# Altium schematic sheet 28Pins_Project_V1I1.SchDoc (part 2 of 3)
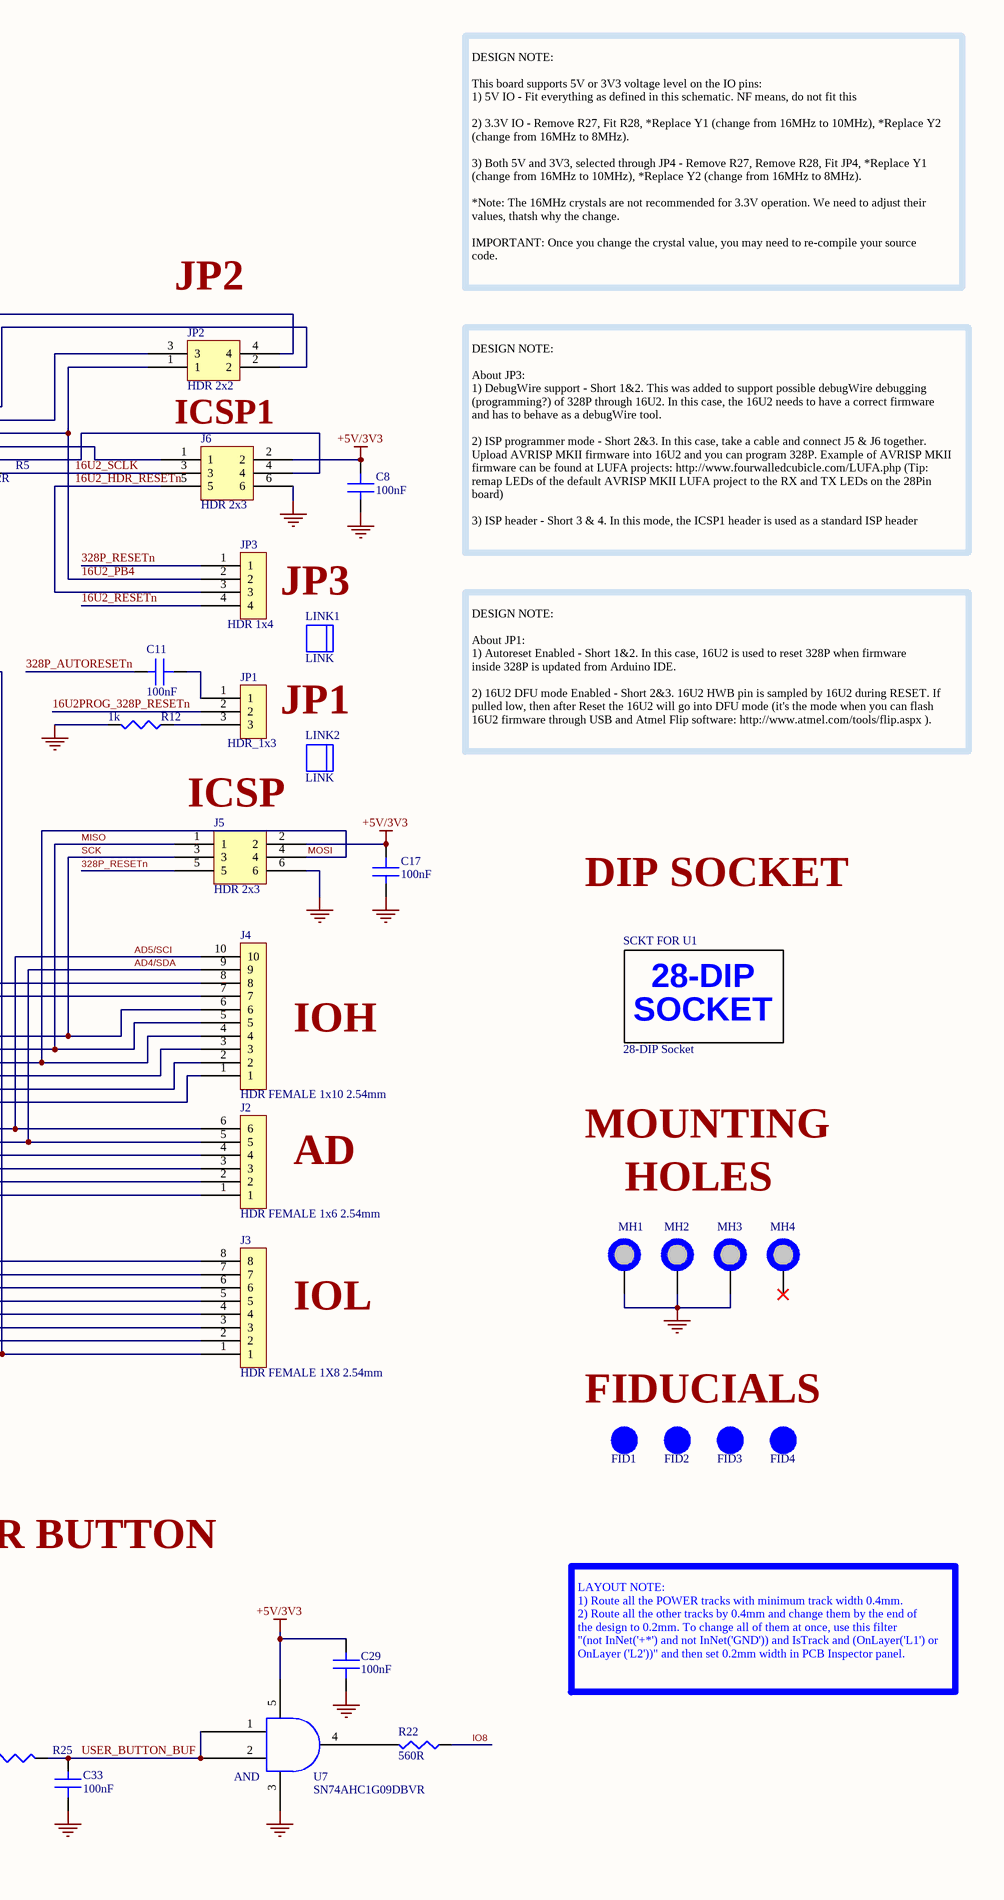
[diagram p2: 28Pins_Project_V1I1.SchDoc, right]
## Library data of the parts
C1 C2 = Tantal Capacitor: CAP ALUM 100UF 20% 10V SMD; Manufacturer: Panasonic; Manufacturer Part Number: EEE-1AA101WR; Ripple Current: 50mA; Life (Hours): 1000Hour; Supplier 1: Arrow Electronics; RoHS: Yes; Category: Aluminum Electrolytic Capacitors; Stock 1: 19000; Pricing 1: 1000=0,06210, 50000=0,05590 (USD); Mount: Surface Mount,PCB; Case/Package: Radial; Contact Plating: Tin; Min Operating Temperature: -40°C; Max Operating Temperature: 85°C; Capacitance: 100uF; Voltage Rating: 10V; Tolerance: 20%; Packaging: Tape and Reel; Package Quantity: 1; Ripple Current (AC): 50mA; Voltage Rating (DC): 10V; Termination: SMD/SMT; Series: S; Construction: Cylindrical; Diameter: 5mm; Length: 5.5mm; Height: 5.4mm; Height - Seated (Max): 0.213inch; Radiation Hardening: No; REACH SVHC: Unknown; Lead Free: Lead Free; RoHS Compliant: Yes; ComponentLink1URL: https://datasheet.ciiva.com/26945/getdatasheetpartid-169213-26945071.pdf?src-supplier=Verical; ComponentLink1Description: https://datasheet.ciiva.com/26945/getdatasheetpartid-169213-26945071.pdf?src-supplier=Verical; ComponentLink2URL: https://datasheet.ciiva.com/24027/aba0000ce2-40801-24027541.pdf?src-supplier=Mouser; ComponentLink2Description: https://datasheet.ciiva.com/24027/aba0000ce2-40801-24027541.pdf?src-supplier=Mouser; ComponentLink3URL: https://datasheet.ciiva.com/14598/70255710-14598233.pdf?src-supplier=Allied+Electronics; ComponentLink3Description: https://datasheet.ciiva.com/14598/70255710-14598233.pdf?src-supplier=Allied+Electronics; ComponentLink4URL: https://datasheet.ciiva.com/14605/70255710-14605689.pdf?src-supplier=Allied+Electronics; ComponentLink4Description: https://datasheet.ciiva.com/14605/70255710-14605689.pdf?src-supplier=Allied+Electronics; ComponentLink5URL: https://datasheet.ciiva.com/11673/aba0000ce2-11673882.pdf?src-supplier=Avnet; ComponentLink5Description: https://datasheet.ciiva.com/11673/aba0000ce2-11673882.pdf?src-supplier=Avnet; ComponentLink6URL: https://datasheet.ciiva.com/16427/aba0000ce2-16427544.pdf?src-supplier=Future+Electronics; ComponentLink6Description: https://datasheet.ciiva.com/16427/aba0000ce2-16427544.pdf?src-supplier=Future+Electronics; ComponentLink7URL: https://datasheet.ciiva.com/2983/aba0000ce2-2983906.pdf?src-supplier=Avnet; ComponentLink7Description: https://datasheet.ciiva.com/2983/aba0000ce2-2983906.pdf?src-supplier=Avnet; ComponentLink8URL: https://datasheet.ciiva.com/30075/11aba0000ce2-30075303.pdf?src-supplier=Onlinecomponents.com; ComponentLink8Description: https://datasheet.ciiva.com/30075/11aba0000ce2-30075303.pdf?src-supplier=Onlinecomponents.com; Supplier Part Number 1: EEE-1AA101WR
C3 C12 C13 C19 C21 C22 C34 = C2012X5R1C106M125AC: CERAMIC CAPACITOR, 10UF, 16V, X5R, 20%, 0805, FULL REEL; Product Range:C Series; Capacitance:10 F; Capacitance Tolerance: 20%; Dielectric Characteristic:X5R; Voltage Rating:16V; Ceramic Capacitor Case:0805 [2012 Metric]; MSL:- ;RoHS Compliant: Yes; Manufacturer: TDK; Supplier 1: Farnell; Manufacturer Part Number: C2012X5R1C106M125AC; RoHS: Yes; Category: Ceramic Capacitors; Pricing 1: 5=0,27200, 50=0,09480, 250=0,08030, 500=0,07090, 1000=0,06220, 2000=0,04880, 10000=0,04830, 20000=0,04180 (GBP); Mount: Surface Mount; Case/Package: 0805; Number of Pins: 2; Case Code (Metric): 2012; Case Code (Imperial): 0805; Dielectric Material: Ceramic; Weight: 0.000194oz; Min Operating Temperature: -55°C; Max Operating Temperature: 85°C; Capacitance: 10uF; Tolerance: 20%; Voltage Rating: 16V; Packaging: Tape and Reel; Voltage Rating (DC): 16V; Dielectric: X5R; Termination: SMD/SMT; Package Quantity: 1; Resistor Type: Ceramic; Series: C; Length: 0.079inch; Width: 0.049inch; Height: 1.25mm; Depth: 1.25mm; Thickness: 0.057inch; RoHS Compliant: Yes; REACH SVHC: No SVHC; Lead Free: Lead Free; ComponentLink1URL: https://datasheet.ciiva.com/6289/tdkmlcccaprange-6289238.pdf?src-supplier=Digi-Key; ComponentLink1Description: https://datasheet.ciiva.com/6289/tdkmlcccaprange-6289238.pdf?src-supplier=Digi-Key; ComponentLink2URL: https://datasheet.ciiva.com/22725/1913358-22725558.pdf?src-supplier=Element14; ComponentLink2Description: https://datasheet.ciiva.com/22725/1913358-22725558.pdf?src-supplier=Element14; ComponentLink3URL: https://datasheet.ciiva.com/6252/tdkmlcccaprange-6252105.pdf?src-supplier=Digi-Key; ComponentLink3Description: https://datasheet.ciiva.com/6252/tdkmlcccaprange-6252105.pdf?src-supplier=Digi-Key; ComponentLink4URL: https://datasheet.ciiva.com/6252/tdkmlcccaprange-6252108.pdf?src-supplier=Digi-Key; ComponentLink4Description: https://datasheet.ciiva.com/6252/tdkmlcccaprange-6252108.pdf?src-supplier=Digi-Key; ComponentLink5URL: https://datasheet.ciiva.com/23803/1796654-23803022.pdf?src-supplier=Newark; ComponentLink5Description: https://datasheet.ciiva.com/23803/1796654-23803022.pdf?src-supplier=Newark; Supplier Part Number 1: 2525134
C4-C6 C8 C11 C14-C17 C20 C23 C24 C26 C28-C33 = CAP 0805 100nF: 100 nF Capacitor
C7 = C2012X5R1E105K125AA: CAP CER 1UF 25V X5R 0805; Manufacturer: TDK; Dielectric Material: Ceramic; Tolerance: 10%; Supplier 1: Arrow Electronics; Manufacturer Part Number: C2012X5R1E105K125AA; RoHS: Yes; Category: Ceramic Capacitors; Stock 1: 900; Pricing 1: 1=0,03980 (USD); Mount: Surface Mount; Case/Package: 0805; Number of Pins: 2; Case Code (Metric): 2012; Case Code (Imperial): 0805; Weight: 0.000194oz; Min Operating Temperature: -55°C; Max Operating Temperature: 85°C; Package Quantity: 2000; Capacitance: 1uF; Voltage Rating: 25V; Packaging: Tape and Reel; Voltage Rating (DC): 25V; Dielectric: X5R; Termination: SMD/SMT; Resistor Type: Ceramic; Voltage: 25V; Series: C; Construction: Flat; Length: 2mm; Width: 0.049inch; Height: 1.25mm; Thickness: 0.057inch; Depth: 1.25mm; Radiation Hardening: No; REACH SVHC: No SVHC; Lead Free: Lead Free; RoHS Compliant: Yes; ComponentLink1URL: https://datasheet.ciiva.com/11787/0900766b80c1bb00-11787608.pdf?src-supplier=RSComponents; ComponentLink1Description: https://datasheet.ciiva.com/11787/0900766b80c1bb00-11787608.pdf?src-supplier=RSComponents; ComponentLink2URL: https://datasheet.ciiva.com/16449/e412-c-16449595.pdf?src-supplier=Future+Electronics; ComponentLink2Description: https://datasheet.ciiva.com/16449/e412-c-16449595.pdf?src-supplier=Future+Electronics; ComponentLink3URL: https://datasheet.ciiva.com/28602/1744655-28602171.pdf?src-supplier=Element14; ComponentLink3Description: https://datasheet.ciiva.com/28602/1744655-28602171.pdf?src-supplier=Element14; ComponentLink4URL: https://datasheet.ciiva.com/15192/getdatasheetpartid-726707-15192140.pdf?src-supplier=Verical; ComponentLink4Description: https://datasheet.ciiva.com/15192/getdatasheetpartid-726707-15192140.pdf?src-supplier=Verical; Supplier Part Number 1: C2012X5R1E105K125AA
C9 C10 C25 C27 = C0805C180J5GACTU: Cap Ceramic 18pF 50V C0G 5% SMD 0805 125C Paper T/R; Manufacturer: KEMET; Temperature Coefficient: 30ppm/°C; Dissipation Factor: 0.1%; Supplier 1: Arrow Electronics; Manufacturer Part Number: C0805C180J5GACTU; RoHS: Yes; Category: Ceramic Capacitors; Stock 1: 32000; Pricing 1: 4000=0,02210, 12000=0,01860 (USD); Mount: Surface Mount,PCB; Case/Package: 0805; Number of Pins: 2; Dielectric Material: Ceramic; Case Code (Imperial): 0805; Case Code (Metric): 2012; Contact Plating: Tin,Matte; Contact Material: Tin; Min Operating Temperature: -55°C; Max Operating Temperature: 125°C; Tolerance: 5%; Capacitance: 18pF; Dielectric: C0G; Packaging: Tape and Reel; Termination: SMD/SMT; Voltage Rating (DC): 50V; Package Quantity: 1; Series: C; Construction: Flat; Voltage: 50V; Voltage Rating: 50V; Length: 2mm; Width: 1.2mm; Height: 0.78mm; Depth: 1.25mm; Lead Pitch: 0.75mm; Thickness: 0.035inch; Radiation Hardening: No; Lead Free: Lead Free; RoHS Compliant: Yes; REACH SVHC: No SVHC; ComponentLink1URL: https://datasheet.ciiva.com/22746/1769375-22746770.pdf?src-supplier=Element14; ComponentLink1Description: https://datasheet.ciiva.com/22746/1769375-22746770.pdf?src-supplier=Element14; ComponentLink2URL: https://datasheet.ciiva.com/26923/getdatasheetpartid-759702-26923980.pdf?src-supplier=Verical; ComponentLink2Description: https://datasheet.ciiva.com/26923/getdatasheetpartid-759702-26923980.pdf?src-supplier=Verical; ComponentLink3URL: https://datasheet.ciiva.com/26847/getdatasheetpartid-385668-26847862.pdf?src-supplier=Verical; ComponentLink3Description: https://datasheet.ciiva.com/26847/getdatasheetpartid-385668-26847862.pdf?src-supplier=Verical; Supplier Part Number 1: C0805C180J5GACTU
D1 = LGL29K-G2J1-24-Z: LED GREEN DIFFUSED 0603 SMD; Manufacturer: Osram Opto; Lens Color: White; Forward Current: 20mA; Forward Voltage: 2.2V; Luminous Intensity: 5.6mcd; Viewing Angle: 160°; Lens Style: Flat,Diffused,Colorless,Rectangular; Test Current: 2mA; Dominant Wavelength: 570nm; Luminous Flux: 0.012lm; Number of LEDs: 1; Reverse Voltage: 12V; Lens Size: 0.8mm; Supplier 1: Newark; Manufacturer Part Number: LGL29K-G2J1-24-Z; RoHS: Yes; Category: LEDs; Mount: Surface Mount; Case/Package: 0603; Number of Pins: 2; Color: Green; Case Code (Metric): 1608; Case Code (Imperial): 0603; Min Operating Temperature: -40°C; Max Operating Temperature: 100°C; Illumination Color: Green; Packaging: Tape and Reel; Package Quantity: 5000; Lens Transparency: Diffused; Number of Elements: 1; Series: SmartLED; Length: 1.3mm; Width: 0.8mm; Height: 0.65mm; Depth: 0.8mm; Radiation Hardening: No; RoHS Compliant: Yes; ComponentLink1URL: https://datasheet.ciiva.com/4689/g-l29k-39844-4689584.pdf?src-supplier=Mouser; ComponentLink1Description: https://datasheet.ciiva.com/4689/g-l29k-39844-4689584.pdf?src-supplier=Mouser; ComponentLink2URL: https://datasheet.ciiva.com/15198/getdatasheetpartid-571127-15198411.pdf?src-supplier=Verical; ComponentLink2Description: https://datasheet.ciiva.com/15198/getdatasheetpartid-571127-15198411.pdf?src-supplier=Verical; ComponentLink3URL: https://datasheet.ciiva.com/2112/00077107-0-2112887.pdf?src-supplier=Digi-Key; ComponentLink3Description: https://datasheet.ciiva.com/2112/00077107-0-2112887.pdf?src-supplier=Digi-Key; ComponentLink4URL: https://datasheet.ciiva.com/2112/00077107-0-2112886.pdf?src-supplier=Digi-Key; ComponentLink4Description: https://datasheet.ciiva.com/2112/00077107-0-2112886.pdf?src-supplier=Digi-Key; ComponentLink5URL: https://datasheet.ciiva.com/2112/00077107-0-2112888.pdf?src-supplier=Digi-Key; ComponentLink5Description: https://datasheet.ciiva.com/2112/00077107-0-2112888.pdf?src-supplier=Digi-Key; Supplier Part Number 1: 35AH2059
D2-D4 = LOL29K-H2K1-24-Z: LED Orange Diffused 0603 SMD; Manufacturer: Osram Opto; Lens Color: White; Forward Current: 20mA; Forward Voltage: 2.2V; Luminous Intensity: 9mcd; Viewing Angle: 160°; Lens Style: Flat,Diffused,Colorless,Rectangular; Test Current: 2mA; Dominant Wavelength: 606nm; Luminous Flux: 0.025lm; Number of LEDs: 1; Reverse Voltage: 12V; Lens Size: 0.8mm; Supplier 1: Newark; Manufacturer Part Number: LOL29K-H2K1-24-Z; RoHS: Yes; Category: Uncategorized; Mount: Surface Mount; Case/Package: 0603; Number of Pins: 2; Color: Orange; Case Code (Metric): 1608; Case Code (Imperial): 0603; Min Operating Temperature: -40°C; Max Operating Temperature: 100°C; Illumination Color: Orange; Packaging: Tape and Reel; Package Quantity: 5000; Lens Transparency: Diffused; Number of Elements: 1; Series: SmartLED; Length: 1.3mm; Width: 0.8mm; Height: 0.65mm; Depth: 0.8mm; Radiation Hardening: No; RoHS Compliant: Yes; ComponentLink1URL: https://datasheet.ciiva.com/2112/00077105-0-2112905.pdf?src-supplier=Digi-Key; ComponentLink1Description: https://datasheet.ciiva.com/2112/00077105-0-2112905.pdf?src-supplier=Digi-Key; ComponentLink2URL: https://datasheet.ciiva.com/2112/00077105-0-2112904.pdf?src-supplier=Digi-Key; ComponentLink2Description: https://datasheet.ciiva.com/2112/00077105-0-2112904.pdf?src-supplier=Digi-Key; ComponentLink3URL: https://datasheet.ciiva.com/2112/00077105-0-2112906.pdf?src-supplier=Digi-Key; ComponentLink3Description: https://datasheet.ciiva.com/2112/00077105-0-2112906.pdf?src-supplier=Digi-Key; ComponentLink4URL: https://datasheet.ciiva.com/15198/getdatasheetpartid-693885-15198412.pdf?src-supplier=Verical; ComponentLink4Description: https://datasheet.ciiva.com/15198/getdatasheetpartid-693885-15198412.pdf?src-supplier=Verical; Supplier Part Number 1: 32AC1122
D5 D6 = BAT54HT1G: Diode Schottky 30V 200mA SOD323; Manufacturer: ON Semiconductor / Fairchild; Forward Voltage: 800mV; Recovery Time: 5ns; Peak Non-Repetitive Surge Current: 600mA; Element Configuration: Single; Max Reverse Current: 2uA; Power Dissipation: 200mW; Polarity: Standard; Capacitance: 10pF; Supplier 1: Arrow Electronics; Manufacturer Part Number: BAT54HT1G; RoHS: Yes; Category: Schottky Diodes; Stock 1: 22896; Pricing 1: 1=0,18420, 10=0,13740, 25=0,13610, 100=0,08460, 250=0,06060, 500=0,06000, 1000=0,04320, 3000=0,03510, 6000=0,03480, 15000=0,02770 (USD); Mount: Surface Mount; Number of Pins: 2; Contact Plating: Tin,Matte; Min Operating Temperature: -55°C; Max Operating Temperature: 150°C; Packaging: Tape and Reel; Forward Current: 200mA; Package Quantity: 3000; Average Rectified Current: 200mA; Reverse Recovery Time: 5ns; Max Repetitive Reverse Voltage (Vrrm): 30V; Max Forward Surge Current (Ifsm): 600mA; Max Reverse Voltage (DC): 30V; Max Surge Current: 600mA; Voltage Rating (DC): 30V; Current Rating: 200mA; Output Current: 200mA; Reverse Voltage: 30V; Max Reverse Leakage Current: 2uA; Length: 1.8mm; Width: 1.35mm; Height: 1mm; Radiation Hardening: No; Lead Free: Lead Free; REACH SVHC: No SVHC; RoHS Compliant: Yes; ComponentLink1URL: https://datasheet.ciiva.com/4452/bat54ht1g-104602-4452889.pdf?src-supplier=Mouser; ComponentLink1Description: https://datasheet.ciiva.com/4452/bat54ht1g-104602-4452889.pdf?src-supplier=Mouser; ComponentLink2URL: https://datasheet.ciiva.com/30479/0900766b811a63a9-30479442.pdf?src-supplier=RSComponents; ComponentLink2Description: https://datasheet.ciiva.com/30479/0900766b811a63a9-30479442.pdf?src-supplier=RSComponents; ComponentLink3URL: https://datasheet.ciiva.com/34301/806549-34301562.pdf?src-supplier=Jameco; ComponentLink3Description: https://datasheet.ciiva.com/34301/806549-34301562.pdf?src-supplier=Jameco; ComponentLink4URL: https://datasheet.ciiva.com/1240/1747983-1240762.pdf?src-supplier=Newark; ComponentLink4Description: https://datasheet.ciiva.com/1240/1747983-1240762.pdf?src-supplier=Newark; ComponentLink5URL: https://datasheet.ciiva.com/4714/bat54ht1-d-72881-4714706.pdf?src-supplier=Mouser; ComponentLink5Description: https://datasheet.ciiva.com/4714/bat54ht1-d-72881-4714706.pdf?src-supplier=Mouser; ComponentLink6URL: https://datasheet.ciiva.com/1180/bat54ht1-d-1180251.pdf?src-supplier=Element14; ComponentLink6Description: https://datasheet.ciiva.com/1180/bat54ht1-d-1180251.pdf?src-supplier=Element14; ComponentLink7URL: https://datasheet.ciiva.com/1180/bat54ht1-d-1180252.pdf?src-supplier=Element14; ComponentLink7Description: https://datasheet.ciiva.com/1180/bat54ht1-d-1180252.pdf?src-supplier=Element14; ComponentLink8URL: https://datasheet.ciiva.com/46429/1727620-46429206.pdf?src-supplier=Element14; ComponentLink8Description: https://datasheet.ciiva.com/46429/1727620-46429206.pdf?src-supplier=Element14; ComponentLink9URL: https://datasheet.ciiva.com/8303/bat54ht1g-8303645.pdf?src-supplier=Avnet; ComponentLink9Description: https://datasheet.ciiva.com/8303/bat54ht1g-8303645.pdf?src-supplier=Avnet; ComponentLink10URL: https://datasheet.ciiva.com/17020/bat54ht1g-17020445.pdf?src-supplier=Future+Electronics; ComponentLink10Description: https://datasheet.ciiva.com/17020/bat54ht1g-17020445.pdf?src-supplier=Future+Electronics; ComponentLink11URL: https://datasheet.ciiva.com/48686/001262925-da-01-en-diode-schottky-30v-bat54ht1g-sod-323-fsc-48686266.pdf?src-supplier=Conrad; ComponentLink11Description: https://datasheet.ciiva.com/48686/001262925-da-01-en-diode-schottky-30v-bat54ht1g-sod-323-fsc-48686266.pdf?src-supplier=Conrad; Supplier Part Number 1: BAT54HT1G
FB1-FB3 = MPZ2012S601AT000: 0805 600Ω ±25% DCR=0.1Ω 2A; Manufacturer: TDK; Impedance: 600R; DC Resistance (DCR): 100mR; Supplier 1: Newark; Manufacturer Part Number: MPZ2012S601AT000; RoHS: Yes; Category: Ferrite Beads and Chips; Pricing 1: 1=0,13000, 25=0,10100, 50=0,07400, 100=0,04600, 250=0,04300, 500=0,03900 (USD); Mount: Surface Mount; Case/Package: 0805; Case Code (Metric): 2012; Case Code (Imperial): 0805; Packaging: Tape and Reel; Package Quantity: 1; Current Rating: 2A; Max DC Current: 2A; Series: MPZ; Length: 0.079inch; Width: 0.049inch; Height: 0.041inch; REACH SVHC: No SVHC; Lead Free: Lead Free; RoHS Compliant: Yes; ComponentLink1URL: https://datasheet.ciiva.com/46634/beads-commercial-power-mpz-en-46634335.pdf?src-supplier=Digi-Key; ComponentLink1Description: https://datasheet.ciiva.com/46634/beads-commercial-power-mpz-en-46634335.pdf?src-supplier=Digi-Key; ComponentLink2URL: https://datasheet.ciiva.com/46634/beads-commercial-power-mpz-en-46634377.pdf?src-supplier=Digi-Key; ComponentLink2Description: https://datasheet.ciiva.com/46634/beads-commercial-power-mpz-en-46634377.pdf?src-supplier=Digi-Key; ComponentLink3URL: https://datasheet.ciiva.com/46634/beads-commercial-power-mpz-en-46634606.pdf?src-supplier=Digi-Key; ComponentLink3Description: https://datasheet.ciiva.com/46634/beads-commercial-power-mpz-en-46634606.pdf?src-supplier=Digi-Key; Supplier Part Number 1: 89R3160
FID1-FID4 = FID_1MMC: Fiducial 40mil Diameter, 120mil mask
J1 J3 = M20-7820842: 2.54mm (0.1") Pitch SIL Vertical PC Tail Socket Assembly, selective gold + tin, 8 contacts; Manufacturer: Harwin; Max Current Rating: 3A; Contact Resistance: 20mR; Number of Positions: 8; Connector Type: Receptacle; Supplier 1: Newark; Manufacturer Part Number: M20-7820842; RoHS: Yes; Category: Headers and Wire Housings; Stock 1: 652; Pricing 1: 1=1,28000, 100=1,01000, 250=0,92300, 500=0,84300, 1000=0,78500 (USD); Mount: Through Hole; Case/Package: SIL; Contact Plating: Tin,Gold; Color: Black; Contact Material: Bronze; Weight: 0.025397oz; Housing Color: Black; Housing Material: Polyamide; Min Operating Temperature: -40°C; Max Operating Temperature: 105°C; Number of Rows: 1; Contact Gender: Female; Package Quantity: 29; Packaging: Rail/Tube; Termination: Solder; Number of Contacts: 8; Orientation: Straight; Gender: Female; Series: M20; Contact Type: Female Socket; Length: 20.72mm; Pitch: 2.54mm; Depth: 2.5mm; Radiation Hardening: No; RoHS Compliant: Yes; ComponentLink1URL: https://datasheet.ciiva.com/9480/m20-782-9480074.pdf?src-supplier=Avnet; ComponentLink1Description: https://datasheet.ciiva.com/9480/m20-782-9480074.pdf?src-supplier=Avnet; Supplier Part Number 1: 29AH6736
J2 = M20-7820646: 2.54mm (0.1") Pitch SIL Vertical PC Tail Socket Assembly, tin, 6 contacts; Manufacturer: Harwin; Max Current Rating: 3A; Contact Resistance: 20mR; Connector Type: Receptacle; Number of Positions: 6; Supplier 1: RSComponents; Manufacturer Part Number: M20-7820646; RoHS: Yes; Category: Headers and Wire Housings; Stock 1: 1; Pricing 1: 5=1,23000, 25=1,08000, 50=0,96600, 100=0,90400, 250=0,84700 (USD); Mount: Through Hole; Case/Package: SIL; Color: Black; Contact Plating: Tin; Contact Material: Bronze; Housing Color: Black; Housing Material: Nylon; Min Operating Temperature: -40°C; Max Operating Temperature: 105°C; Packaging: Rail/Tube; Number of Rows: 1; Contact Gender: Female; Package Quantity: 38; Termination: Solder; Number of Contacts: 6; Orientation: Straight; Gender: Female; Series: M20; Contact Type: Female Socket; Length: 15.64mm; Pitch: 2.54mm; Depth: 2.5mm; Radiation Hardening: No; RoHS Compliant: Yes; ComponentLink1URL: http://www.harwin.com/include/downloads/pdfs/2010PAGE120.PDF?src-supplier=Avnet; ComponentLink1Description: http://www.harwin.com/include/downloads/pdfs/2010PAGE120.PDF?src-supplier=Avnet; ComponentLink2URL: https://cdn.harwin.com/pdfs/M20-782.pdf?src-supplier=Digi-Key; ComponentLink2Description: https://cdn.harwin.com/pdfs/M20-782.pdf?src-supplier=Digi-Key; ComponentLink3URL: https://cdn.harwin.com/pdfs/Harwin_PC_Connectors_M20.pdf?src-supplier=RSComponents; ComponentLink3Description: https://cdn.harwin.com/pdfs/Harwin_PC_Connectors_M20.pdf?src-supplier=RSComponents; ComponentLink4URL: https://cdn.harwin.com/pdfs/Harwin_PC_Connectors_M20.pdf?src-supplier=Mouser; ComponentLink4Description: https://cdn.harwin.com/pdfs/Harwin_PC_Connectors_M20.pdf?src-supplier=Mouser; ComponentLink5URL: https://cdn.harwin.com/pdfs/Harwin_PC_Connectors_M20.pdf?src-supplier=TTI; ComponentLink5Description: https://cdn.harwin.com/pdfs/Harwin_PC_Connectors_M20.pdf?src-supplier=TTI; Supplier Part Number 1: 1613692
J4 = M20-7821046: 2.54mm (0.1") Pitch SIL Vertical PC Tail Socket Assembly, tin, 10 contacts; Manufacturer: Harwin; Number of Contacts: 10; Connector Type: Receptacle,Socket; Gender: Receptacle; Insulation Resistance: 1MR; Max Current Rating: 3A; Contact Resistance: 20mR; Mating Cycles: 50; Hole Diameter: 0.8mm; Supplier 1: RSComponents; Manufacturer Part Number: M20-7821046; RoHS: Yes; Category: Headers and Wire Housings; Stock 1: 1; Pricing 1: 5=1,58400, 100=1,21200, 375=1,09300, 1500=0,88600, 3000=0,80100 (USD); Mount: Through Hole; Case/Package: SIL; Housing Color: Black; Color: Black; Contact Plating: Tin; Contact Material: Bronze; Housing Material: Polyamide; Min Operating Temperature: -40°C; Max Operating Temperature: 105°C; Termination: Solder; Number of Rows: 1; Orientation: Straight; Number of Positions: 10; Packaging: Rail/Tube; Contact Gender: Female; Package Quantity: 23; Current Rating: 3A; Length: 25.8mm; Pitch: 2.54mm; Depth: 2.5mm; Lead Pitch: 2.54mm; Radiation Hardening: No; REACH SVHC: No SVHC; ComponentLink1URL: https://datasheet.ciiva.com/26899/getdatasheetpartid-559226-26899379.pdf?src-supplier=Verical; ComponentLink1Description: https://datasheet.ciiva.com/26899/getdatasheetpartid-559226-26899379.pdf?src-supplier=Verical; ComponentLink2URL: https://datasheet.ciiva.com/11753/0900766b80dc1d2b-11753869.pdf?src-supplier=RSComponents; ComponentLink2Description: https://datasheet.ciiva.com/11753/0900766b80dc1d2b-11753869.pdf?src-supplier=RSComponents; ComponentLink3URL: https://datasheet.ciiva.com/6785/m20-782-6785605.pdf?src-supplier=Digi-Key; ComponentLink3Description: https://datasheet.ciiva.com/6785/m20-782-6785605.pdf?src-supplier=Digi-Key; ComponentLink4URL: https://datasheet.ciiva.com/10151/m20-782-10151366.pdf?src-supplier=Avnet; ComponentLink4Description: https://datasheet.ciiva.com/10151/m20-782-10151366.pdf?src-supplier=Avnet; Supplier Part Number 1: 6816826P
J5 J6 = M20-9720345: 03+03 DIL Vert Pin Hdr; Manufacturer: Harwin; Gender: Male; Connector Type: Male Pin; Number of Positions: 6; Max Current Rating: 3A; Contact Resistance: 25mR; Pitch: 2.54mm; Row Spacing: 0.1inch; Supplier 1: Newark; Manufacturer Part Number: M20-9720345; RoHS: Yes; Category: Headers and Wire Housings; Stock 1: 1509; Pricing 1: 10=0,30000, 100=0,27500, 250=0,24600, 500=0,22800, 1000=0,19900, 2500=0,18600, 5000=0,17700 (USD); Mount: Through Hole; Housing Color: Black; Housing Material: Nylon; Contact Plating: Gold; Color: Black; Contact Material: Brass; Min Operating Temperature: -40°C; Max Operating Temperature: 105°C; Orientation: Straight; Termination: Solder; Number of Contacts: 6; Number of Rows: 2; Package Quantity: 1000; Packaging: Bulk; Length: 7.62mm; Contact Mating Length: 0.276inch; Depth: 5.08mm; Radiation Hardening: No; ComponentLink1URL: https://datasheet.ciiva.com/6814/m20-972-6814777.pdf?src-supplier=Digi-Key; ComponentLink1Description: https://datasheet.ciiva.com/6814/m20-972-6814777.pdf?src-supplier=Digi-Key; ComponentLink2URL: https://datasheet.ciiva.com/5160/m20-972-5160251.pdf?src-supplier=Mouser; ComponentLink2Description: https://datasheet.ciiva.com/5160/m20-972-5160251.pdf?src-supplier=Mouser; Supplier Part Number 1: 29AH6785
J7 = MICRO USB: CONN USB MICRO B RECPT SMT R/A; Manufacturer: Amphenol ICC / FCI; Supplier 1: RSComponents; Manufacturer Part Number: 10118193-0001LF; RoHS: No; Category: USB Connectors; Stock 1: 3200; Pricing 1: 100=0,25200, 500=0,22100, 1000=0,18900, 2500=0,17700, 5000=0,16400 (GBP); ComponentLink1URL: http://uk.rs-online.com/webdocs/1450/0900766b814507f1.pdf?src-supplier=RSComponents; ComponentLink1Description: http://uk.rs-online.com/webdocs/1450/0900766b814507f1.pdf?src-supplier=RSComponents; ComponentLink2URL: https://cdn.amphenol-icc.com/media/wysiwyg/files/documentation/datasheet/inputoutput/io_usb_micro.pdf?src-supplier=RSComponents; ComponentLink2Description: https://cdn.amphenol-icc.com/media/wysiwyg/files/documentation/datasheet/inputoutput/io_usb_micro.pdf?src-supplier=RSComponents; ComponentLink3URL: http://www.amphenol-icc.com/media/wysiwyg/files/drawing/10118193.pdf?src-supplier=Digi-Key; ComponentLink3Description: http://www.amphenol-icc.com/media/wysiwyg/files/drawing/10118193.pdf?src-supplier=Digi-Key; ComponentLink4URL: https://cdn.amphenol-icc.com/media/wysiwyg/files/documentation/datasheet/inputoutput/io_usb_micro.pdf?src-supplier=Digi-Key; ComponentLink4Description: https://cdn.amphenol-icc.com/media/wysiwyg/files/documentation/datasheet/inputoutput/io_usb_micro.pdf?src-supplier=Digi-Key; ComponentLink5URL: https://cdn.amphenol-icc.com/media/wysiwyg/files/documentation/datasheet/inputoutput/io_usb_micro.pdf?src-supplier=Onlinecomponents.com; ComponentLink5Description: https://cdn.amphenol-icc.com/media/wysiwyg/files/documentation/datasheet/inputoutput/io_usb_micro.pdf?src-supplier=Onlinecomponents.com; ComponentLink6URL: https://cdn.amphenol-icc.com/media/wysiwyg/files/documentation/datasheet/inputoutput/io_usb_micro.pdf?src-supplier=Verical; ComponentLink6Description: https://cdn.amphenol-icc.com/media/wysiwyg/files/documentation/datasheet/inputoutput/io_usb_micro.pdf?src-supplier=Verical; ComponentLink7URL: https://cdn.amphenol-icc.com/media/wysiwyg/files/documentation/datasheet/inputoutput/io_usb_micro.pdf?src-supplier=Allied+Electronics; ComponentLink7Description: https://cdn.amphenol-icc.com/media/wysiwyg/files/documentation/datasheet/inputoutput/io_usb_micro.pdf?src-supplier=Allied+Electronics; ComponentLink8URL: https://cdn.amphenol-icc.com/media/wysiwyg/files/documentation/datasheet/inputoutput/io_usb_micro.pdf?src-supplier=Mouser; ComponentLink8Description: https://cdn.amphenol-icc.com/media/wysiwyg/files/documentation/datasheet/inputoutput/io_usb_micro.pdf?src-supplier=Mouser; ComponentLink9URL: https://cdn.amphenol-icc.com/media/wysiwyg/files/documentation/datasheet/inputoutput/io_usb_micro.pdf?src-supplier=Avnet; ComponentLink9Description: https://cdn.amphenol-icc.com/media/wysiwyg/files/documentation/datasheet/inputoutput/io_usb_micro.pdf?src-supplier=Avnet; ComponentLink10URL: https://cdn.amphenol-icc.com/media/wysiwyg/files/documentation/datasheet/inputoutput/io_usb_micro.pdf?src-supplier=Arrow+Electronics; ComponentLink10Description: https://cdn.amphenol-icc.com/media/wysiwyg/files/documentation/datasheet/inputoutput/io_usb_micro.pdf?src-supplier=Arrow+Electronics; ComponentLink11URL: https://cdn.amphenol-icc.com/media/wysiwyg/files/documentation/datasheet/inputoutput/io_usb_micro.pdf?src-supplier=TTI; ComponentLink11Description: https://cdn.amphenol-icc.com/media/wysiwyg/files/documentation/datasheet/inputoutput/io_usb_micro.pdf?src-supplier=TTI; ComponentLink12URL: https://cdn.amphenol-icc.com/media/wysiwyg/files/documentation/datasheet/inputoutput/io_usb_micro.pdf?src-supplier=TME; ComponentLink12Description: https://cdn.amphenol-icc.com/media/wysiwyg/files/documentation/datasheet/inputoutput/io_usb_micro.pdf?src-supplier=TME; ComponentLink13URL: https://cdn.amphenol-icc.com/media/wysiwyg/files/documentation/datasheet/inputoutput/io_usb_micro.pdf?src-supplier=Heilind+Electronics; ComponentLink13Description: https://cdn.amphenol-icc.com/media/wysiwyg/files/documentation/datasheet/inputoutput/io_usb_micro.pdf?src-supplier=Heilind+Electronics; Supplier Part Number 1: 8632989
J8 J9 = PAD_WITH_HOLE_4MMx1.5MM: Pad with a hole 4mm x 1.5mm
JP1 JP4 = 68000-103HLF: Conn Unshrouded Header HDR 3 POS 2.54mm Solder ST Top Entry Thru-Hole BergStik® Automotive Bulk; Manufacturer: Amphenol ICC / FCI; Supplier 1: Avnet; Manufacturer Part Number: 68000-103HLF; RoHS: No; Category: Headers and Wire Housings; Stock 1: 23084; ComponentLink1URL: https://datasheet.ciiva.com/46392/1914865-46392021.pdf?src-supplier=Element14; ComponentLink1Description: https://datasheet.ciiva.com/46392/1914865-46392021.pdf?src-supplier=Element14; Supplier Part Number 1: 68000-103HLF
JP2 = Header - 68602-204HLF: Conn Unshrouded Header HDR 4 POS 2.54mm Solder ST Top Entry Thru-Hole BergStik® Bulk; Manufacturer: AMPHENOL ICC (FCI); Supplier 1: Newark; Manufacturer Part Number: 68602-204HLF; RoHS: No; Supplier Part Number 1: 28AH8858
JP3 = 68001-204HLF: HDR 4 POS 2.54mm Solder ST Thru-Hole Bag / Conn Unshrouded Header; Manufacturer: Amphenol ICC; Supplier 1: Newark; Manufacturer Part Number: 68001-204HLF; RoHS: Yes; Category: Headers and Wire Housings; ComponentLink1URL: http://www.farnell.com/cad/2615197.pdf?src-supplier=Farnell; ComponentLink1Description: http://www.farnell.com/cad/2615197.pdf?src-supplier=Farnell; ComponentLink2URL: http://www.farnell.com/cad/2615197.pdf?src-supplier=Newark; ComponentLink2Description: http://www.farnell.com/cad/2615197.pdf?src-supplier=Newark; Supplier Part Number 1: 38AH4588
L1 = INDUCTOR: FIXED IND 2.2UH 2A 80 MOHM SMD; Manufacturer: KEMET; Manufacturer Part Number: L1210R2R2MDWIT; Core Material: Ferrite; Tolerance: 20%; Shielding: Unshielded; Self Resonant Frequency: 190MHz; DC Resistance (DCR): 80mR; Test Frequency: 100kHz; DC Current: 1.13A; Supplier 1: Arrow Electronics; RoHS: Yes; Category: Fixed Inductors; Stock 1: 215; Pricing 1: 1=0,43700, 10=0,31660, 25=0,31340, 100=0,28340 (USD); Mount: Surface Mount; Case/Package: 1210; Case Code (Metric): 3225; Case Code (Imperial): 1210; Min Operating Temperature: -40°C; Max Operating Temperature: 105°C; Package Quantity: 1000; Current Rating: 2A; Packaging: Tape and Reel; Inductance Tolerance: 20%; Resistor Type: Wirewound,Ceramic; Inductance: 2.2uH; Max DC Current: 2A; Termination: SMD/SMT; Series: L-DWI; Length: 0.126inch; Width: 0.098inch; Height: 2.5mm; Height - Seated (Max): 0.106inch; Depth: 2.7mm; Radiation Hardening: No; REACH SVHC: No SVHC; Military Standard: Not; RoHS Compliant: Yes; ComponentLink1URL: https://datasheet.ciiva.com/4957/f3115-4957838.pdf?src-supplier=Mouser; ComponentLink1Description: https://datasheet.ciiva.com/4957/f3115-4957838.pdf?src-supplier=Mouser; ComponentLink2URL: https://datasheet.ciiva.com/6691/f3115-6691487.pdf?src-supplier=Digi-Key; ComponentLink2Description: https://datasheet.ciiva.com/6691/f3115-6691487.pdf?src-supplier=Digi-Key; ComponentLink3URL: https://datasheet.ciiva.com/8512/f3115-8512543.pdf?src-supplier=Avnet; ComponentLink3Description: https://datasheet.ciiva.com/8512/f3115-8512543.pdf?src-supplier=Avnet; ComponentLink4URL: https://datasheet.ciiva.com/22685/27262-22685038.pdf?src-supplier=Element14; ComponentLink4Description: https://datasheet.ciiva.com/22685/27262-22685038.pdf?src-supplier=Element14; Supplier Part Number 1: L1210R2R2MDWIT
LINK1-LINK3 = LINK: CONN JUMPER SHORTING .100* GOLD; Manufacturer: Sullins; Manufacturer Part Number: QPC02SXGN-RC; Supplier 1: Digi-Key; RoHS: Yes; Category: Connectors; Stock 1: 1342003; Pricing 1: 1=0,10000, 10=0,05000, 25=0,04080, 50=0,03780, 100=0,03650, 250=0,03152, 500=0,03024, 2000=0,02520, 4000=0,02394 (USD); ComponentLink1URL: https://datasheet.ciiva.com/767/284-sxgn-11510-767869.pdf?src-supplier=Digi-Key; ComponentLink1Description: https://datasheet.ciiva.com/767/284-sxgn-11510-767869.pdf?src-supplier=Digi-Key; Supplier Part Number 1: S9337-ND
MH1-MH3 = MH_7.4MMC_3.2MMD: Mounting Hole 7.4mm Diameter, 3.2mm Drill
MH4 = MH_7.4MMNC_3.2MMD: Hole 7.4mm Diameter (Non Copper,) 3.2mm Drill NPTH
R1 R4 R14 R18-R21 = Res SMD 10K Ohm RC0805FR-0710KL: Res Thick Film 0805 10K Ohm 1% 0.125W(1/8W) +/-100ppm/C Epoxy Pad SMD T/R; Manufacturer: Yageo; Resistance: 10kR; Temperature Coefficient: 100ppm/°C; Power Rating: 125mW; Voltage Rating: 150V; Supplier 1: Arrow Electronics; Manufacturer Part Number: RC0805FR-0710KL; RoHS: Yes; Category: Chip SMD Resistors; Stock 1: 440000; Pricing 1: 5000=0,00390 (USD); Case/Package: 0805; Case Code (Imperial): 0805; Case Code (Metric): 2012; Size Code: 0805; Min Operating Temperature: -55°C; Max Operating Temperature: 155°C; Packaging: Tape and Reel; Tolerance: 1%; Resistor Type: Thick Film; Package Quantity: 1; Termination: SMD/SMT; Number of Terminations: 2; Max Power Dissipation: 125mW; Features: Moisture Resistant; Series: RC; Construction: Rectangular; Resistance Tolerance: 1%; Technology: THICK FILM; Length: 2mm; Width: 0.049inch; Height: 0.024inch; Depth: 1.25mm; REACH SVHC: Unknown; Lead Free: Lead Free; Military Standard: Not; RoHS Compliant: Yes; Supplier Part Number 1: RC0805FR-0710KL
R2 R3 R15 R17 R22 = RC0805FR-07560RL: RES SMD 560 OHM 1% 1/8W 0805; Manufacturer: Yageo; Power Rating: 125mW; Temperature Coefficient: 100ppm/°C; Voltage Rating: 150V; Supplier 1: Arrow Electronics; Manufacturer Part Number: RC0805FR-07560RL; RoHS: Yes; Category: Chip SMD Resistors; Stock 1: 155000; Pricing 1: 5000=0,00300, 50000=0,00250 (USD); Case/Package: 0805; Case Code (Metric): 2012; Case Code (Imperial): 0805; Weight: 0.000194oz; Size Code: 0805; Min Operating Temperature: -55°C; Max Operating Temperature: 155°C; Tolerance: 1%; Resistance: 560R; Packaging: Tape and Reel; Package Quantity: 1; Resistor Type: Thick Film; Number of Terminations: 2; Termination: SMD/SMT; Max Power Dissipation: 125mW; Features: Moisture Resistant; Series: RC; Resistance Tolerance: 1%; Construction: Rectangular; Length: 2mm; Width: 0.049inch; Height: 0.024inch; Depth: 1.25mm; REACH SVHC: Unknown; Lead Free: Lead Free; Military Standard: Not; RoHS Compliant: Yes; ComponentLink1URL: https://datasheet.ciiva.com/2457/pyu-r-int-thick-7-2457141.pdf?src-supplier=Digi-Key; ComponentLink1Description: https://datasheet.ciiva.com/2457/pyu-r-int-thick-7-2457141.pdf?src-supplier=Digi-Key; ComponentLink2URL: https://datasheet.ciiva.com/2457/pyu-r-int-thick-7-2457142.pdf?src-supplier=Digi-Key; ComponentLink2Description: https://datasheet.ciiva.com/2457/pyu-r-int-thick-7-2457142.pdf?src-supplier=Digi-Key; ComponentLink3URL: https://datasheet.ciiva.com/2457/pyu-r-int-thick-7-2457140.pdf?src-supplier=Digi-Key; ComponentLink3Description: https://datasheet.ciiva.com/2457/pyu-r-int-thick-7-2457140.pdf?src-supplier=Digi-Key; ComponentLink4URL: https://datasheet.ciiva.com/5561/rc0805-5561861.pdf?src-supplier=Mouser; ComponentLink4Description: https://datasheet.ciiva.com/5561/rc0805-5561861.pdf?src-supplier=Mouser; ComponentLink5URL: https://datasheet.ciiva.com/7941/444164-7941814.pdf?src-supplier=Element14; ComponentLink5Description: https://datasheet.ciiva.com/7941/444164-7941814.pdf?src-supplier=Element14; ComponentLink6URL: https://datasheet.ciiva.com/7941/444164-7941813.pdf?src-supplier=Element14; ComponentLink6Description: https://datasheet.ciiva.com/7941/444164-7941813.pdf?src-supplier=Element14; Supplier Part Number 1: RC0805FR-07560RL
R5-R7 R13 R23-R25 = Res SMD 22 Ohm: Res Thick Film 0805 22 Ohm 1% 0.125W(1/8W) ±100ppm/C Pad SMD T/R; Manufacturer: Yageo; Manufacturer Part Number: RC0805FR-0722RL; Temperature Coefficient: 100ppm/°C; Power Rating: 125mW; Voltage Rating: 150V; Supplier 1: Arrow Electronics; RoHS: Yes; Category: Chip SMD Resistors; Stock 1: 6214; Pricing 1: 1=0,05910, 10=0,03330, 25=0,02610, 100=0,01460, 250=0,01440, 500=0,01320, 1000=0,01150, 3000=0,00630, 6000=0,00530 (USD); Case/Package: 0805; Case Code (Metric): 2012; Case Code (Imperial): 0805; Min Operating Temperature: -55°C; Max Operating Temperature: 155°C; Resistor Type: Thick Film; Resistance: 22R; Tolerance: 1%; Packaging: Tape and Reel; Package Quantity: 1; Number of Terminations: 2; Termination: SMD/SMT; Max Power Dissipation: 125mW; Working Voltage: 150V; Features: Moisture Resistant; Series: RC; Resistance Tolerance: 1%; Construction: Rectangular; Technology: THICK FILM; Length: 0.079inch; Width: 0.049inch; Height: 0.024inch; Depth: 1.25mm; REACH SVHC: Unknown; Lead Free: Lead Free; RoHS Compliant: Yes; Military Standard: Not; ComponentLink1URL: https://datasheet.ciiva.com/11819/0900766b8106beab-11819837.pdf?src-supplier=RSComponents; ComponentLink1Description: https://datasheet.ciiva.com/11819/0900766b8106beab-11819837.pdf?src-supplier=RSComponents; ComponentLink2URL: https://datasheet.ciiva.com/46447/444164-46447574.pdf?src-supplier=Element14; ComponentLink2Description: https://datasheet.ciiva.com/46447/444164-46447574.pdf?src-supplier=Element14; ComponentLink3URL: https://datasheet.ciiva.com/2457/pyu-r-int-thick-7-2457045.pdf?src-supplier=Digi-Key; ComponentLink3Description: https://datasheet.ciiva.com/2457/pyu-r-int-thick-7-2457045.pdf?src-supplier=Digi-Key; ComponentLink4URL: https://datasheet.ciiva.com/2457/pyu-r-int-thick-7-2457046.pdf?src-supplier=Digi-Key; ComponentLink4Description: https://datasheet.ciiva.com/2457/pyu-r-int-thick-7-2457046.pdf?src-supplier=Digi-Key; ComponentLink5URL: https://datasheet.ciiva.com/2457/pyu-r-int-thick-7-2457044.pdf?src-supplier=Digi-Key; ComponentLink5Description: https://datasheet.ciiva.com/2457/pyu-r-int-thick-7-2457044.pdf?src-supplier=Digi-Key; ComponentLink6URL: https://datasheet.ciiva.com/12667/rc0805-12667371.pdf?src-supplier=Mouser; ComponentLink6Description: https://datasheet.ciiva.com/12667/rc0805-12667371.pdf?src-supplier=Mouser; Supplier Part Number 1: RC0805FR-0722RL
R8 R26-R28 = RC0805JR-070RL: RES SMD 0.0 OHM JUMPER 1/8W 0805; Manufacturer: Yageo; Resistance: 0mR; Tolerance: 5%; Voltage Rating: 150V; Power Rating: 125mW; Temperature Coefficient: 200ppm/°C; Supplier 1: Arrow Electronics; Manufacturer Part Number: RC0805JR-070RL; RoHS: Yes; Category: Chip SMD Resistors; Stock 1: 5605000; Pricing 1: 5000=0,00430, 10000=0,00380, 25000=0,00350, 50000=0,00270 (USD); Case/Package: 0805; Number of Pins: 2; Case Code (Imperial): 0805; Case Code (Metric): 2012; Contact Plating: Tin,Matte; Size Code: 0805; Min Operating Temperature: -55°C; Max Operating Temperature: 155°C; Packaging: Tape and Reel; Voltage Rating (DC): 150V; Termination: SMD/SMT; Resistor Type: Thick Film; Features: Moisture Resistant; Series: RC; Max Power Dissipation: 125mW; Number of Terminations: 2; Construction: Rectangular; Technology: THICK FILM; Resistance Tolerance: 5%; Length: 2mm; Width: 1.25mm; Height: 0.5mm; Depth: 1.25mm; Radiation Hardening: No; REACH SVHC: Unknown; Military Standard: Not; Lead Free: Lead Free; RoHS Compliant: Yes; ComponentLink1URL: https://datasheet.ciiva.com/11819/0900766b8106beab-11819430.pdf?src-supplier=RSComponents; ComponentLink1Description: https://datasheet.ciiva.com/11819/0900766b8106beab-11819430.pdf?src-supplier=RSComponents; ComponentLink2URL: https://datasheet.ciiva.com/7941/1738694-7941861.pdf?src-supplier=Element14; ComponentLink2Description: https://datasheet.ciiva.com/7941/1738694-7941861.pdf?src-supplier=Element14; ComponentLink3URL: https://datasheet.ciiva.com/7941/1738694-7941862.pdf?src-supplier=Element14; ComponentLink3Description: https://datasheet.ciiva.com/7941/1738694-7941862.pdf?src-supplier=Element14; ComponentLink4URL: https://datasheet.ciiva.com/7941/1738694-7941863.pdf?src-supplier=Element14; ComponentLink4Description: https://datasheet.ciiva.com/7941/1738694-7941863.pdf?src-supplier=Element14; ComponentLink5URL: https://datasheet.ciiva.com/15190/getdatasheetpartid-330685-15190028.pdf?src-supplier=Verical; ComponentLink5Description: https://datasheet.ciiva.com/15190/getdatasheetpartid-330685-15190028.pdf?src-supplier=Verical; Supplier Part Number 1: RC0805JR-070RL
R9 R16 = RC0805FR-071ML: Res Thick Film 0805 1M Ohm 1% 0.125W(1/8W) ±100ppm/C Pad SMD T/R; Manufacturer: Yageo; Resistance: 1MR; Power Rating: 125mW; Temperature Coefficient: 100ppm/°C; Voltage Rating: 150V; Supplier 1: Arrow Electronics; Manufacturer Part Number: RC0805FR-071ML; RoHS: Yes; Category: Chip SMD Resistors; Stock 1: 445000; Pricing 1: 5000=0,00470 (USD); Case/Package: 0805; Case Code (Metric): 2012; Case Code (Imperial): 0805; Size Code: 0805; Min Operating Temperature: -55°C; Max Operating Temperature: 155°C; Tolerance: 1%; Packaging: Tape and Reel; Resistor Type: Thick Film; Package Quantity: 1; Number of Terminations: 2; Termination: SMD/SMT; Max Power Dissipation: 125mW; Features: Moisture Resistant; Series: RC; Construction: Rectangular; Resistance Tolerance: 1%; Length: 0.079inch; Width: 0.049inch; Height: 0.024inch; Depth: 1.25mm; REACH SVHC: Unknown; Lead Free: Lead Free; RoHS Compliant: Yes; Military Standard: Not; Supplier Part Number 1: RC0805FR-071ML
R10-R12 = Res SMD 1K Ohm: RES SMD 1K OHM 1% 1/8W 0805; Manufacturer: Yageo; Manufacturer Part Number: RC0805FR-071KL; Resistance: 1kR; Temperature Coefficient: 100ppm/°C; Voltage Rating (DC): 150V; Power Rating: 125mW; Supplier 1: Arrow Electronics; RoHS: Yes; Category: Chip SMD Resistors; Stock 1: 11600000; Pricing 1: 5000=0,00270 (USD); Case/Package: 0805; Number of Pins: 2; Case Code (Metric): 2012; Case Code (Imperial): 0805; Size Code: 0805; Min Operating Temperature: -55°C; Max Operating Temperature: 155°C; Tolerance: 1%; Packaging: Tape and Reel; Resistor Type: Thick Film; Package Quantity: 1; Voltage Rating: 150V; Number of Terminations: 2; Termination: SMD/SMT; Max Power Dissipation: 125mW; Features: Moisture Resistant; Series: RC; Resistance Tolerance: 1%; Construction: Rectangular; Length: 0.079inch; Width: 0.049inch; Height: 0.024inch; Depth: 1.25mm; REACH SVHC: Unknown; Lead Free: Lead Free; RoHS Compliant: Yes; Military Standard: Not; ComponentLink1URL: https://datasheet.ciiva.com/7941/1686128-7941719.pdf?src-supplier=Element14; ComponentLink1Description: https://datasheet.ciiva.com/7941/1686128-7941719.pdf?src-supplier=Element14; ComponentLink2URL: https://datasheet.ciiva.com/46385/444164-46385020.pdf?src-supplier=Element14; ComponentLink2Description: https://datasheet.ciiva.com/46385/444164-46385020.pdf?src-supplier=Element14; ComponentLink3URL: https://datasheet.ciiva.com/2456/pyu-r-int-thick-7-2456976.pdf?src-supplier=Digi-Key; ComponentLink3Description: https://datasheet.ciiva.com/2456/pyu-r-int-thick-7-2456976.pdf?src-supplier=Digi-Key; ComponentLink4URL: https://datasheet.ciiva.com/2456/pyu-r-int-thick-7-2456977.pdf?src-supplier=Digi-Key; ComponentLink4Description: https://datasheet.ciiva.com/2456/pyu-r-int-thick-7-2456977.pdf?src-supplier=Digi-Key; ComponentLink5URL: https://datasheet.ciiva.com/2456/pyu-r-int-thick-7-2456975.pdf?src-supplier=Digi-Key; ComponentLink5Description: https://datasheet.ciiva.com/2456/pyu-r-int-thick-7-2456975.pdf?src-supplier=Digi-Key; ComponentLink6URL: https://datasheet.ciiva.com/16850/rc0805-16850409.pdf?src-supplier=Future+Electronics; ComponentLink6Description: https://datasheet.ciiva.com/16850/rc0805-16850409.pdf?src-supplier=Future+Electronics; Supplier Part Number 1: RC0805FR-071KL
SCKT_FOR_U1 = 4828-3004-CP: CONN IC DIP SOCKET 28POS TIN; Manufacturer: 3M; Supplier 1: Digi-Key; Manufacturer Part Number: 4828-3004-CP; RoHS: Yes; Category: Connectors; Stock 1: 626; Pricing 1: 1=0,95000, 10=0,80000, 25=0,76680, 40=0,75050, 80=0,71788, 230=0,65265, 440=0,58739, 945=0,52213, 2400=0,47318 (USD); ComponentLink1URL: https://datasheet.ciiva.com/768/ts1099-768354.pdf?src-supplier=Digi-Key; ComponentLink1Description: https://datasheet.ciiva.com/768/ts1099-768354.pdf?src-supplier=Digi-Key; Supplier Part Number 1: 3M5480-ND
SW1 SW2 = Button: Switch Tactile SPST -NO 0.05A 24V; Manufacturer: TE Connectivity Alcoswitch; Supplier 1: Arrow Electronics; Manufacturer Part Number: 1825910-6; RoHS: Yes; Category: Pushbutton Switches; Stock 1: 108909; Pricing 1: 1=0,10270, 10=0,10020, 25=0,09390, 100=0,08200, 250=0,08120, 500=0,07420, 1000=0,06350, 2500=0,06120, 5000=0,05690 (USD); ComponentLink1URL: https://datasheet.ciiva.com/30199/1825910-6rqpn1825910-6-30199520.pdf?src-supplier=Onlinecomponents.com; ComponentLink1Description: https://datasheet.ciiva.com/30199/1825910-6rqpn1825910-6-30199520.pdf?src-supplier=Onlinecomponents.com; ComponentLink2URL: https://datasheet.ciiva.com/15184/getdatasheetpartid-395915-15184509.pdf?src-supplier=Verical; ComponentLink2Description: https://datasheet.ciiva.com/15184/getdatasheetpartid-395915-15184509.pdf?src-supplier=Verical; Supplier Part Number 1: 1825910-6
U1 = ATMEGA328P-PU: ATMEGA328P-PU; 8 bit Microcontroller AVR 20MHz 1; 32kb Flash; 2kb RAM; I2C SPI 2; Manufacturer: Microchip / Atmel; Number of PWM Channels: 6; Number of Timers/Counters: 3; Min Supply Voltage: 1.8V; Max Supply Voltage: 5.5V; Interface: I2C,SPI,UART,USART,2-Wire; Number of I/Os: 23; Oscillator Type: Internal; Data Bus Width: 8b; Number of SPI Channels: 1; Watchdog Timer: Yes; Peripherals: Brown-out Detect/Reset,POR,PWM,WDT; Supplier 1: Newark; Manufacturer Part Number: ATMEGA328P-PU; RoHS: Yes; Category: Microcontrollers; Mount: Through Hole; Case/Package: PDIP; Number of Pins: 28; Contact Plating: Tin,Matte; Min Operating Temperature: -40°C; Max Operating Temperature: 85°C; Package Quantity: 14; Core Architecture: AVR; Series: AVR® ATmega; RAM Size: 2KB; Number of ADC Channels: 6; Packaging: Rail/Tube; Frequency: 20MHz; Number of Programmable I/O: 23; Max Frequency: 20MHz; Number of I2C Channels: 1; Memory Type: FLASH; Memory Size: 32KB; Length: 37.4mm; Width: 6.76mm; Height: 3.28mm; Radiation Hardening: No; REACH SVHC: No SVHC; Lead Free: Lead Free; RoHS Compliant: Yes; ComponentLink1URL: https://datasheet.ciiva.com/1157/1684409-1157696.pdf?src-supplier=Element14; ComponentLink1Description: https://datasheet.ciiva.com/1157/1684409-1157696.pdf?src-supplier=Element14; ComponentLink2URL: https://datasheet.ciiva.com/19457/2139111-19457070.pdf?src-supplier=Jameco; ComponentLink2Description: https://datasheet.ciiva.com/19457/2139111-19457070.pdf?src-supplier=Jameco; ComponentLink3URL: https://datasheet.ciiva.com/29119/155197-da-01-en-microcontr-atmega328p-pu-8bit-pdip-28-29119593.pdf?src-supplier=Conrad; ComponentLink3Description: https://datasheet.ciiva.com/29119/155197-da-01-en-microcontr-atmega328p-pu-8bit-pdip-28-29119593.pdf?src-supplier=Conrad; ComponentLink4URL: https://datasheet.ciiva.com/15213/getdatasheetpartid-318533-15213133.pdf?src-supplier=Verical; ComponentLink4Description: https://datasheet.ciiva.com/15213/getdatasheetpartid-318533-15213133.pdf?src-supplier=Verical; Supplier Part Number 1: 68T2944
U2 = ATMEGA16U2-AU: 8-bit AVR MCU, 16 KB, 512 Bytes, 16 MHz, 2.7 to 5.5V, TQFP-32, RoHS; Manufacturer: Microchip / Atmel; Interface: SPI,UART,USB,USART,Serial; Frequency: 16MHz; Data Bus Width: 8b; Memory Type: FLASH; Memory Size: 16KB; RAM Size: 512B; Number of I/Os: 22; Number of Timers/Counters: 2; Min Supply Voltage: 2.7V; Oscillator Type: Internal; Watchdog Timer: Yes; Peripherals: Brown-out Detect/Reset,POR,PWM,WDT; Number of PWM Channels: 5; Number of SPI Channels: 1; Supplier 1: Newark; Manufacturer Part Number: ATMEGA16U2-AU; RoHS: Yes; Category: Microcontrollers; Mount: Surface Mount; Case/Package: A; Number of Pins: 32; Contact Plating: Tin,Matte; Min Operating Temperature: -40°C; Max Operating Temperature: 85°C; Core Architecture: AVR; Package Quantity: 1250; Packaging: Tray; Series: AVR® ATmega; Max Supply Voltage: 5.5V; Number of Programmable I/O: 22; Max Frequency: 16MHz; Length: 7mm; Width: 7mm; Height: 1.05mm; REACH SVHC: No SVHC; Lead Free: Lead Free; RoHS Compliant: Yes; ComponentLink1URL: https://datasheet.ciiva.com/13036/doc7799-28769-13036800.pdf?src-supplier=Mouser; ComponentLink1Description: https://datasheet.ciiva.com/13036/doc7799-28769-13036800.pdf?src-supplier=Mouser; ComponentLink2URL: https://datasheet.ciiva.com/22651/doc7799-22651110.pdf?src-supplier=Farnell; ComponentLink2Description: https://datasheet.ciiva.com/22651/doc7799-22651110.pdf?src-supplier=Farnell; Supplier Part Number 1: 68T2598
U3 = 3.3V REG: IC REG LDO 3.3V 1.5A SOT223-6; Manufacturer: Texas Instruments; Dropout Voltage: 340mV; Number of Outputs: 1; Max Input Voltage: 20V; Min Input Voltage: 2.1V; Min Current Limit: 1.6A; Input Bias Current: 1mA; Polarity: Positive; Accuracy: 3%; Output Type: Fixed; Supplier 1: Mouser; Manufacturer Part Number: TL1963A-33DCQR; RoHS: Yes; Category: Voltage Regulators - Linear; Pricing 1: 1=3,62000, 10=3,26000, 25=3,08000, 50=3,08000, 100=2,67000, 250=2,53000, 500=2,27000, 1000=1,99000, 2500=1,98000, 10000=1,98000 (USD); Case/Package: SOT-223; Number of Pins: 6; Contact Plating: Gold; Min Operating Temperature: -40°C; Max Operating Temperature: 125°C; Package Quantity: 1; Packaging: Tape and Reel; Output Voltage: 3.3V; Output Current: 1.5A; Max Output Current: 1.5A; Number of Regulators: 1; Quiescent Current: 1mA; Max Output Voltage: 3.3V; Min Output Voltage: 3.3V; Series: -; Radiation Hardening: No; Lead Free: Lead Free; RoHS Compliant: Yes; ComponentLink1URL: https://datasheet.ciiva.com/2046/tl1963a-2046162.pdf?src-supplier=Digi-Key; ComponentLink1Description: https://datasheet.ciiva.com/2046/tl1963a-2046162.pdf?src-supplier=Digi-Key; ComponentLink2URL: https://datasheet.ciiva.com/2046/tl1963a-2046161.pdf?src-supplier=Digi-Key; ComponentLink2Description: https://datasheet.ciiva.com/2046/tl1963a-2046161.pdf?src-supplier=Digi-Key; ComponentLink3URL: https://datasheet.ciiva.com/2046/tl1963a-2046163.pdf?src-supplier=Digi-Key; ComponentLink3Description: https://datasheet.ciiva.com/2046/tl1963a-2046163.pdf?src-supplier=Digi-Key; Supplier Part Number 1: 595-TL1963A-33DCQR